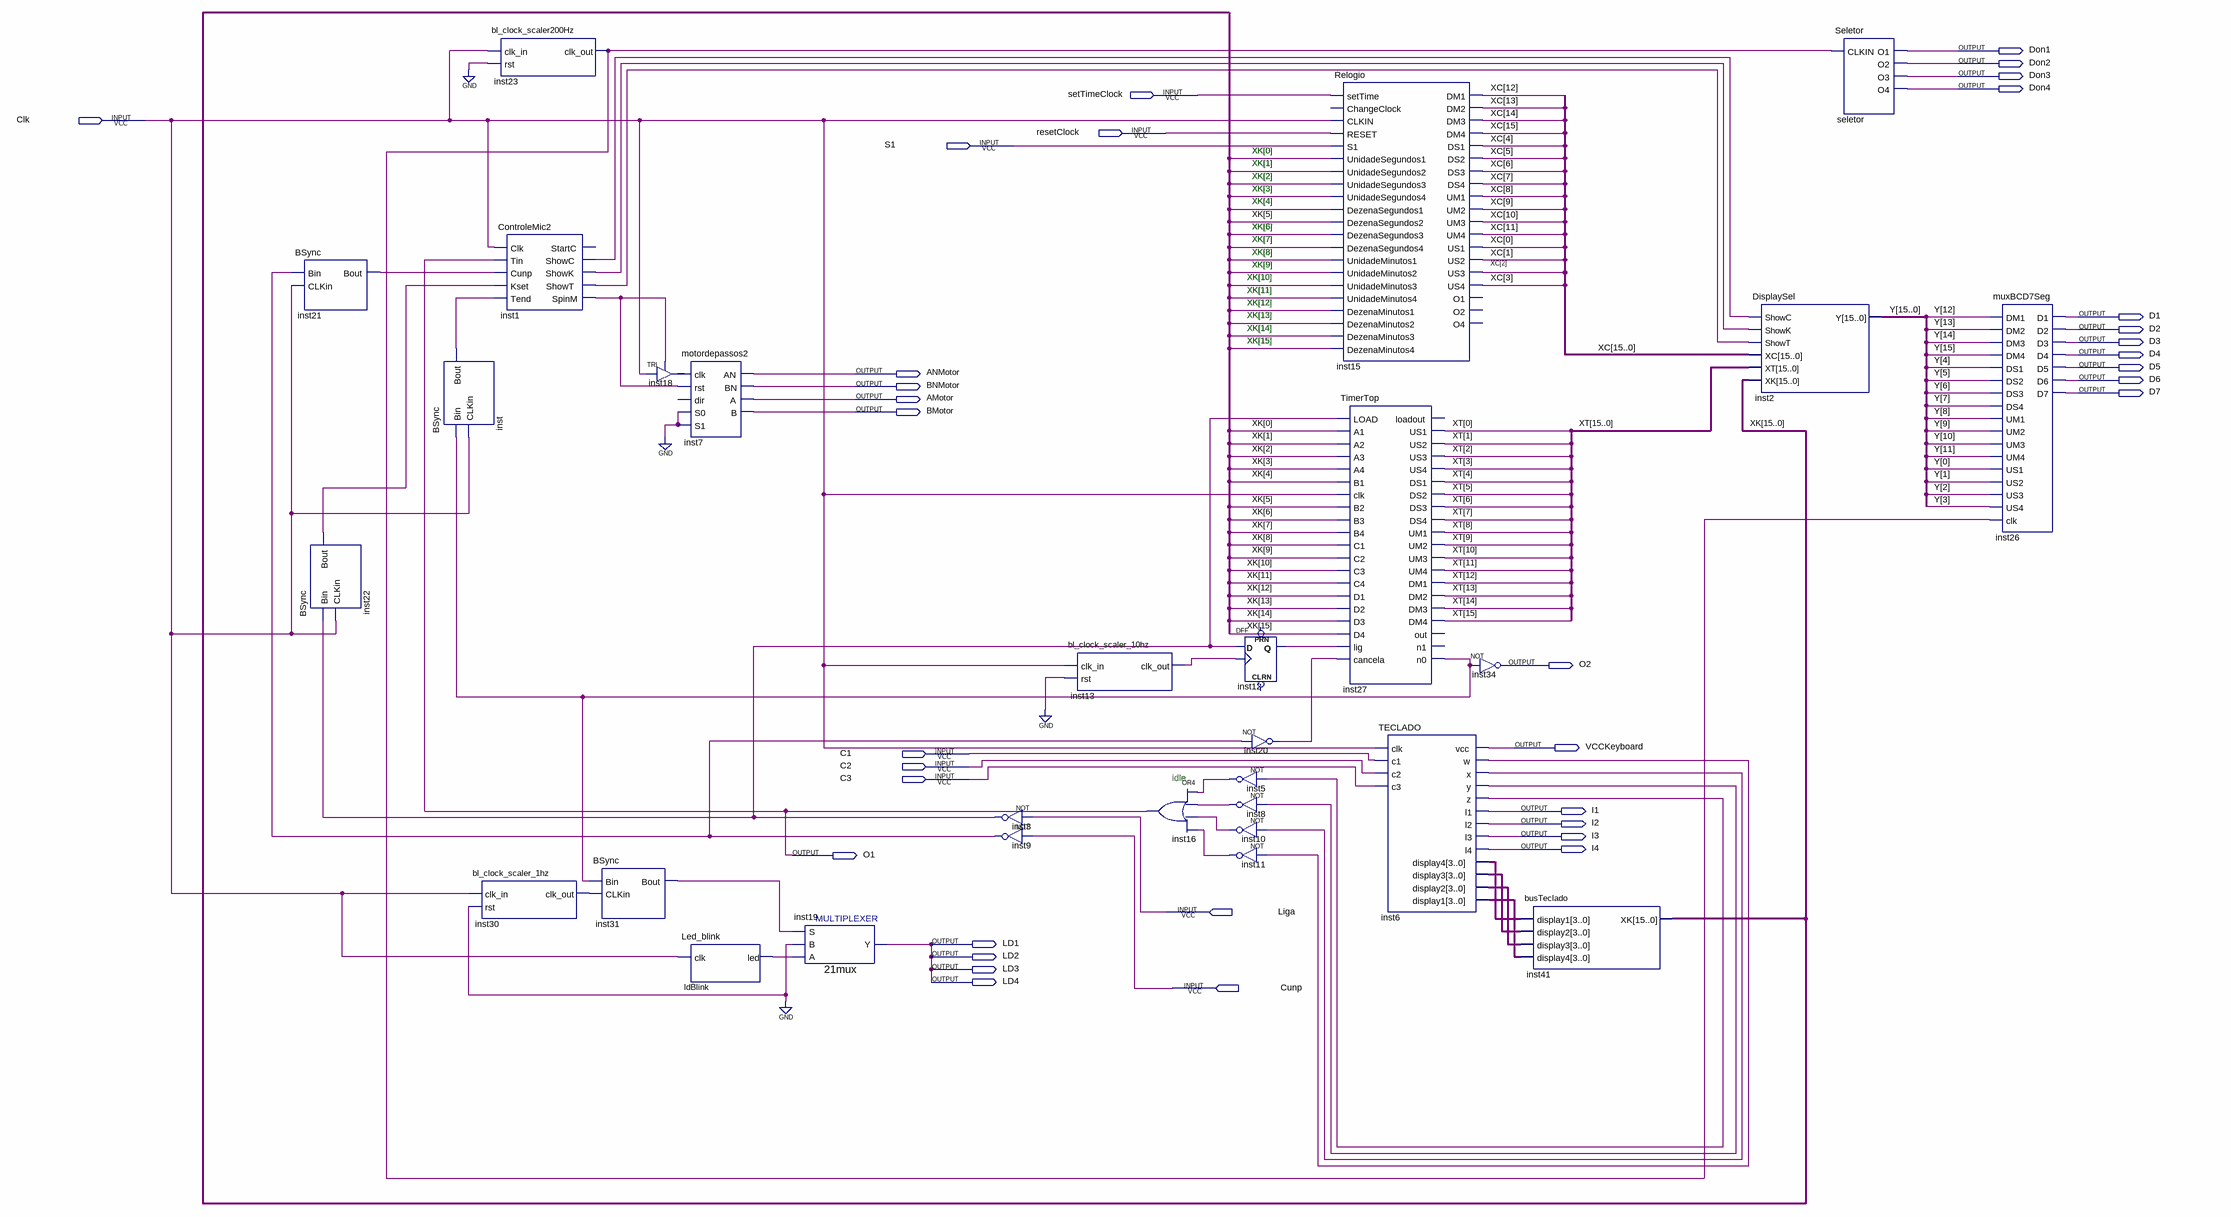
[diagram p0: schematic sheet]
// Quartus schematic Microondas2.bdf as structural Verilog: 29 symbols, 35 pins
module Microondas2 (
  input  setTimeClock,
  input  Clk,
  input  resetClock,
  input  S1,
  input  C1,
  input  C2,
  input  C3,
  input  Liga,
  input  Cunp,
  output Don1,
  output Don2,
  output Don3,
  output Don4,
  output D1,
  output D2,
  output D3,
  output D4,
  output D5,
  output ANMotor,
  output D6,
  output BNMotor,
  output D7,
  output AMotor,
  output BMotor,
  output O2,
  output VCCKeyboard,
  output I1,
  output I2,
  output I3,
  output I4,
  output O1,
  output LD1,
  output LD2,
  output LD3,
  output LD4
);

  wire inst1_showc, inst1_showk, inst1_showt, inst1_spinm, inst3_out, inst5_out, inst6_w, inst6_x, inst6_y,
       inst6_z, inst8_out, inst9_out, inst10_out, inst11_out, inst12_q, inst13_clk_out, inst18_out,
       inst20_out, inst21_bout, inst22_bout, inst23_clk_out, inst27_n0, inst30_clk_out, inst31_bout,
       inst_bout, ldBlink_led;
  wire [3:0] inst6_display1, inst6_display2, inst6_display3, inst6_display4;
  wire [15:0] XC, XK, XT, Y;

  BSync inst21 (.Bin(inst9_out), .CLKin(Clk), .Bout(inst21_bout));
  BSync inst22 (.Bin(inst3_out), .CLKin(Clk), .Bout(inst22_bout));
  BSync inst (.Bin(inst27_n0), .CLKin(Clk), .Bout(inst_bout));
  bl_clock_scaler200Hz inst23 (.clk_in(Clk), .rst(1'b0), .clk_out(inst23_clk_out));
  ControleMic2 inst1 (
    .Clk(Clk), .Tin(O1), .Cunp(inst21_bout), .Kset(inst22_bout), .Tend(inst_bout), .ShowC(inst1_showc),
    .ShowK(inst1_showk), .ShowT(inst1_showt), .SpinM(inst1_spinm));  // open: StartC
  bl_clock_scaler_1hz inst30 (.clk_in(Clk), .rst(1'b0), .clk_out(inst30_clk_out));
  BSync inst31 (.Bin(inst27_n0), .CLKin(inst30_clk_out), .Bout(inst31_bout));
  TRI inst18 (.IN(Clk), .OE(inst1_spinm), .OUT(inst18_out));
  motordepassos2 inst7 (
    .clk(inst18_out), .rst(inst1_spinm), .S0(1'b0), .S1(1'b0), .AN(ANMotor), .BN(BNMotor), .A(AMotor),
    .B(BMotor));  // open: dir
  Led_blink ldBlink (.clk(Clk), .led(ldBlink_led));
  \21mux  inst19 (.S(inst31_bout), .B(1'b0), .A(ldBlink_led), .Y(LD1));
  not inst3 (inst3_out, Liga);
  not inst9 (inst9_out, Cunp);
  bl_clock_scaler_10hz inst13 (.clk_in(Clk), .rst(1'b0), .clk_out(inst13_clk_out));
  or inst16 (O1, inst5_out, inst8_out, inst10_out, inst11_out);
  DFF inst12 (.CLK(inst13_clk_out), .D(inst3_out), .Q(inst12_q));  // open: CLRN, PRN
  not inst20 (inst20_out, inst9_out);
  not inst5 (inst5_out, inst6_z);
  not inst8 (inst8_out, inst6_y);
  not inst10 (inst10_out, inst6_x);
  not inst11 (inst11_out, inst6_w);
  Relogio inst15 (
    .setTime(setTimeClock), .CLKIN(Clk), .RESET(resetClock), .S1(S1), .UnidadeSegundos1(XK[0]),
    .UnidadeSegundos2(XK[1]), .UnidadeSegundos3(XK[2]), .UnidadeSegundos4(XK[3]), .DezenaSegundos1(XK[4]),
    .DezenaSegundos2(XK[5]), .DezenaSegundos3(XK[6]), .DezenaSegundos4(XK[7]), .UnidadeMinutos1(XK[8]),
    .UnidadeMinutos2(XK[9]), .UnidadeMinutos3(XK[10]), .UnidadeMinutos4(XK[11]), .DezenaMinutos1(XK[12]),
    .DezenaMinutos2(XK[13]), .DezenaMinutos3(XK[14]), .DezenaMinutos4(XK[15]), .DM1(XC[12]), .DM2(XC[13]),
    .DM3(XC[14]), .DM4(XC[15]), .DS1(XC[4]), .DS2(XC[5]), .DS3(XC[6]), .DS4(XC[7]), .UM1(XC[8]), .UM2(XC[9]),
    .UM3(XC[10]), .UM4(XC[11]), .US1(XC[0]), .US2(XC[1]), .US3(XC[2]), .US4(XC[3]));  // open: ChangeClock, O1, O2, O4
  TimerTop inst27 (
    .LOAD(inst3_out), .A1(XK[0]), .A2(XK[1]), .A3(XK[2]), .A4(XK[3]), .B1(XK[4]), .clk(Clk), .B2(XK[5]),
    .B3(XK[6]), .B4(XK[7]), .C1(XK[8]), .C2(XK[9]), .C3(XK[10]), .C4(XK[11]), .D1(XK[12]), .D2(XK[13]),
    .D3(XK[14]), .D4(XK[15]), .lig(inst12_q), .cancela(inst20_out), .US1(XT[0]), .US2(XT[1]), .US3(XT[2]),
    .US4(XT[3]), .DS1(XT[4]), .DS2(XT[5]), .DS3(XT[6]), .DS4(XT[7]), .UM1(XT[8]), .UM2(XT[9]), .UM3(XT[10]),
    .UM4(XT[11]), .DM1(XT[12]), .DM2(XT[13]), .DM3(XT[14]), .DM4(XT[15]), .n0(inst27_n0));  // open: loadout, out, n1
  TECLADO inst6 (
    .clk(Clk), .c1(C1), .c2(C2), .c3(C3), .vcc(VCCKeyboard), .w(inst6_w), .x(inst6_x), .y(inst6_y),
    .z(inst6_z), .l1(I1), .l2(I2), .l3(I3), .l4(I4), .display4(inst6_display4), .display3(inst6_display3),
    .display2(inst6_display2), .display1(inst6_display1));
  not inst34 (O2, inst27_n0);
  busTeclado inst41 (
    .display1(inst6_display4), .display2(inst6_display3), .display3(inst6_display2),
    .display4(inst6_display1), .XK(XK));
  DisplaySel inst2 (.ShowC(inst1_showc), .ShowK(inst1_showk), .ShowT(inst1_showt), .XC(XC), .XT(XT), .XK(XK), .Y(Y));
  Seletor seletor (.CLKIN(inst23_clk_out), .O1(Don1), .O2(Don2), .O3(Don3), .O4(Don4));
  muxBCD7Seg inst26 (
    .DM1(Y[12]), .DM2(Y[13]), .DM3(Y[14]), .DM4(Y[15]), .DS1(Y[4]), .DS2(Y[5]), .DS3(Y[6]), .DS4(Y[7]),
    .UM1(Y[8]), .UM2(Y[9]), .UM3(Y[10]), .UM4(Y[11]), .US1(Y[0]), .US2(Y[1]), .US3(Y[2]), .US4(Y[3]),
    .clk(inst23_clk_out), .D1(D1), .D2(D2), .D3(D3), .D4(D4), .D5(D5), .D6(D6), .D7(D7));

  assign LD2 = LD1;
  assign LD3 = LD1;
  assign LD4 = LD1;

  // Notes on the sheet:
  //   XK[0]
  //   XK[1]
  //   XK[2]
  //   XK[3]
  //   XK[4]
  //   XK[5]
  //   XK[6]
  //   XK[7]
  //   XK[8]
  //   XK[9]
  //   XK[10]
  //   XK[11]
  //   XK[12]
  //   XK[13]
  //   XK[14]
  //   XK[15]
  //   idle
endmodule
